# EAGLE design BUZZI-46-3 (EAGLE 5.02)
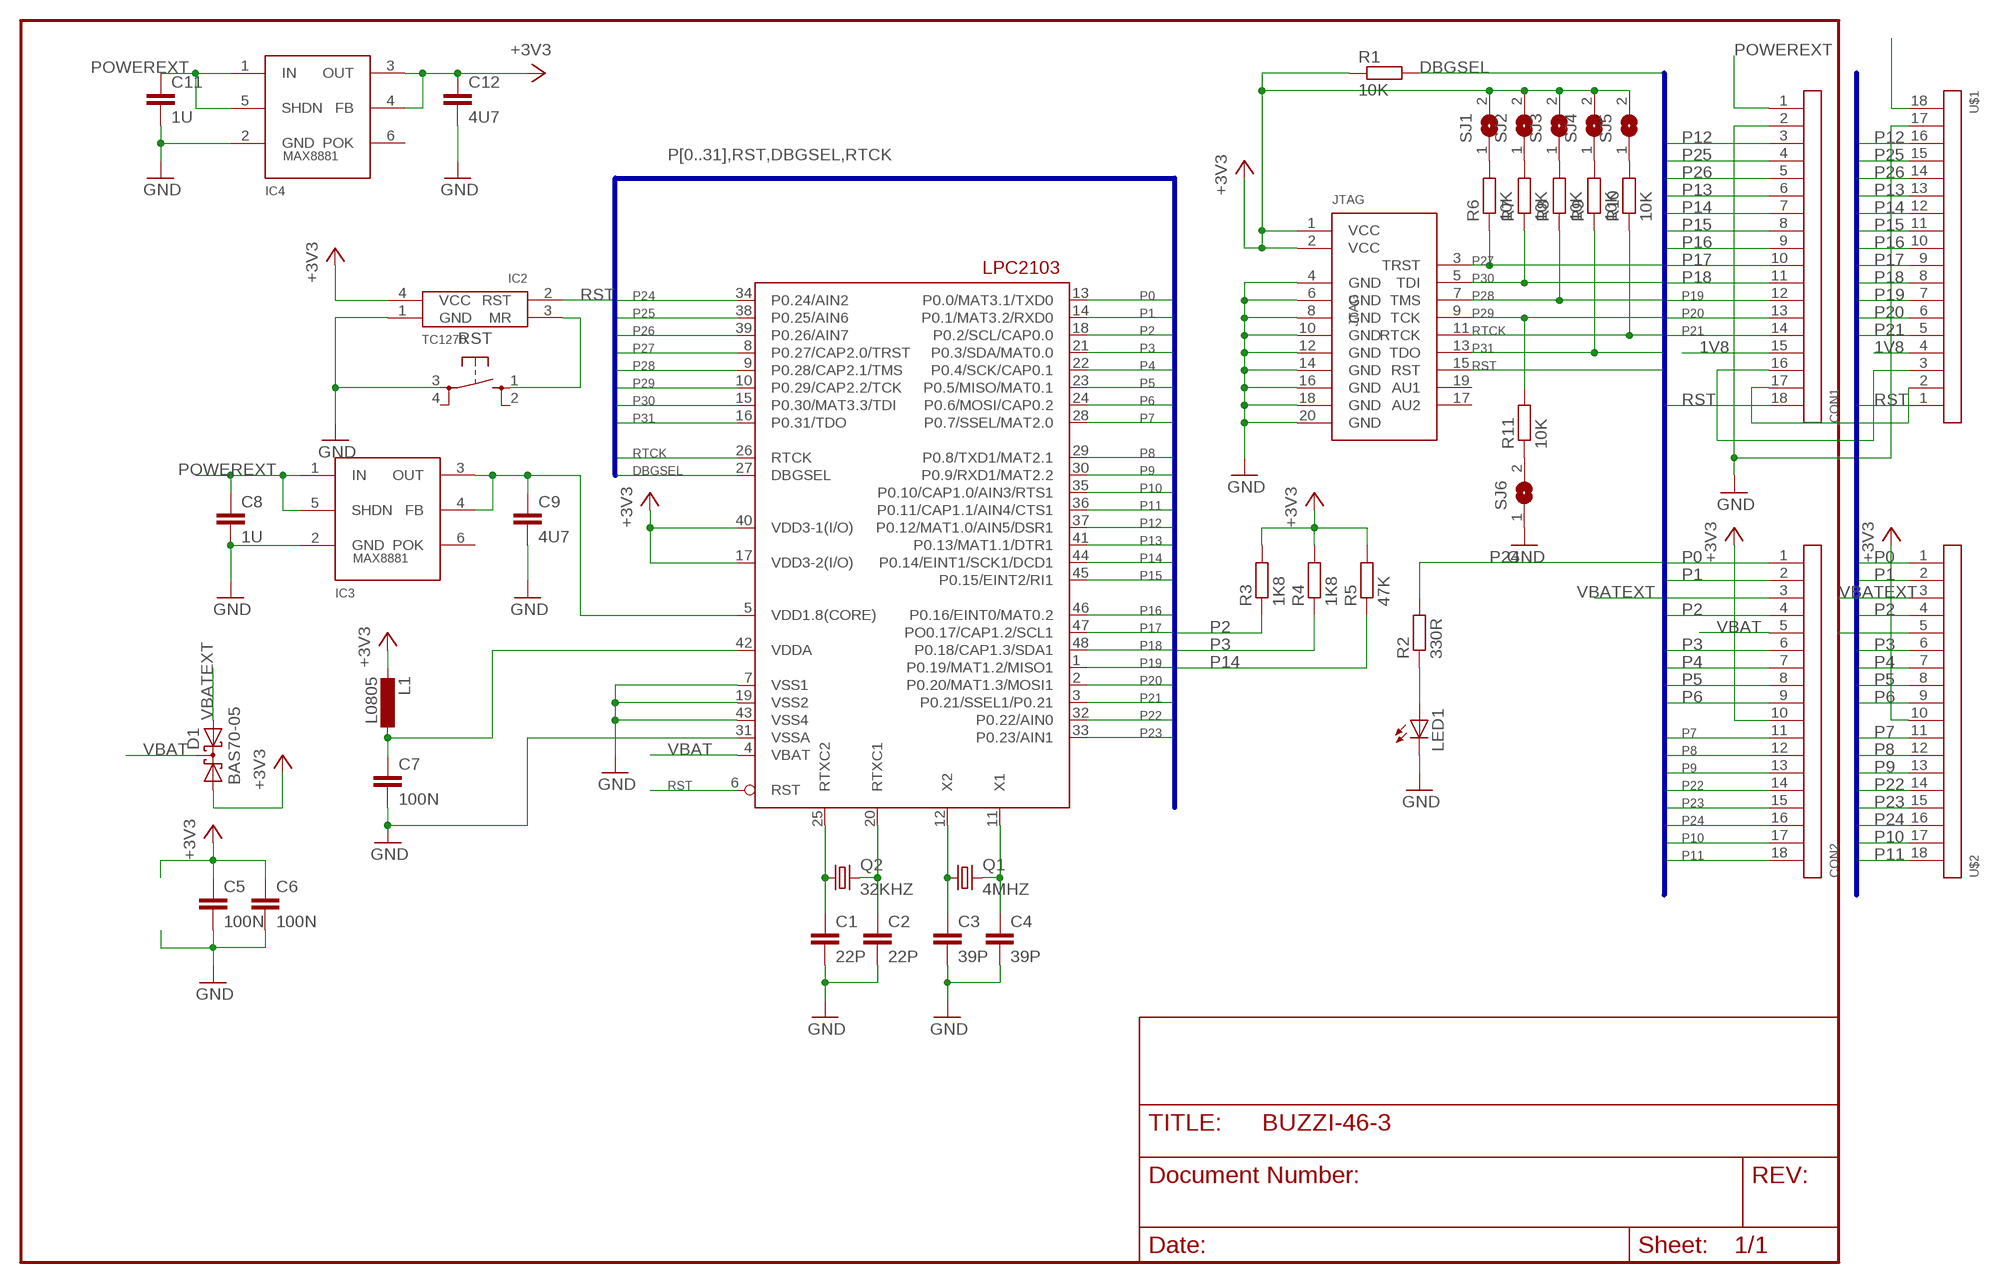
[diagram p0: schematic, sheet 1]

## Parts
C1  22P  C-EUC0603K  [C0603K]
C2  22P  C-EUC0603K  [C0603K]
C3  39P  C-EUC0603K  [C0603K]
C4  39P  C-EUC0603K  [C0603K]
C5  100N  C-EUC0805  [C0805]
C6  100N  C-EUC0805  [C0805]
C7  100N  C-EUC0603  [C0603]
C8  1U  C-EUC0805  [C0805]
C9  4U7  C-EUC0805  [C0805]
C11  1U  C-EUC0805  [C0805]
C12  4U7  C-EUC0805  [C0805]
CON1  CON18  [MA18-1]
CON2  CON18  [MA18-1]
D1  BAS70-05  [SOT23]
IC1  LPC2103  [LQFP48]
IC2  TC1270  [SOT143R_INFINEON]
IC3  MAX8881-18  MAX8881  [SOT23-6L]
IC4  MAX8881-33  MAX8881  [SOT23-6L]
JTAG  ARM-JTAGVERTIKAL  [ML20]
L1  L0805  [C0805]
LED1  LEDCHIPLED_0805  [CHIPLED_0805]
Q1  4MHZ  CRYTALHC49S  [HC49/S]
Q2  32KHZ  CRYTALTC26V  [TC26V]
R1  10K  R-EU_M0805  [M0805]
R2  330R  R-EU_M0805  [M0805]
R3  1K8  R-EU_M0805  [M0805]
R4  1K8  R-EU_M0805  [M0805]
R5  47K  R-EU_M0805  [M0805]
R6  10K  R-EU_M0805  [M0805]
R7  10K  R-EU_M0805  [M0805]
R8  10K  R-EU_M0805  [M0805]
R9  10K  R-EU_M0805  [M0805]
R10  10K  R-EU_M0805  [M0805]
R11  10K  R-EU_M0805  [M0805]
RST  10XXSMD  [B3F-10XX-SMD]
SJ1  SJ  [SJ]
SJ2  SJ  [SJ]
SJ3  SJ  [SJ]
SJ4  SJ  [SJ]
SJ5  SJ  [SJ]
SJ6  SJ  [SJ]
U$1  CON18  [MA18-1]
U$2  CON18  [MA18-1]

## Nets
1V8: C9.1 CON1.15 IC1.5(VDD1.8(CORE)) IC3.3(OUT) IC3.4(FB) U$1.4
+3V3: C5.1 C6.1 C12.1 CON2.10 D1.1(A1) IC1.17(VDD3-2(I/O)) IC1.40(VDD3-1(I/O)) IC2.4(VCC) IC4.3(OUT) IC4.4(FB) JTAG.1(VCC) JTAG.2(VCC) L1.2 R1.1 R3.2 R4.2 R5.2 SJ1.2 SJ2.2 SJ3.2 SJ4.2 SJ5.2 U$2.10
DBGSEL: IC1.27(DBGSEL) R1.2
GND: C1.2 C2.2 C3.2 C4.2 C5.2 C6.2 C7.2 C8.2 C9.2 C11.2 C12.2 CON1.2 IC1.7(VSS1) IC1.19(VSS2) IC1.31(VSSA) IC1.43(VSS4) IC2.1(GND) IC3.2(GND) IC4.2(GND) JTAG.4(GND) JTAG.6(GND) JTAG.8(GND) JTAG.10(GND) JTAG.12(GND) JTAG.14(GND) JTAG.16(GND) JTAG.18(GND) JTAG.20(GND) LED1.C RST.3 SJ6.1 U$1.17
N$1: IC2.3(MR) RST.1
N$2: R6.2 SJ1.1
N$3: LED1.A R2.1
N$4: C7.1 IC1.42(VDDA) L1.1
N$5: R7.2 SJ2.1
N$6: R8.2 SJ3.1
N$7: R9.2 SJ4.1
N$8: R10.2 SJ5.1
N$9: R11.1 SJ6.2
N$10: CON1.16 U$1.3
N$11: CON1.17 U$1.2
P0: CON2.1 IC1.13(P0.0/MAT3.1/TXD0) U$2.1
P1: CON2.2 IC1.14(P0.1/MAT3.2/RXD0) U$2.2
P2: CON2.4 IC1.18(P0.2/SCL/CAP0.0) R3.1 U$2.4
P3: CON2.6 IC1.21(P0.3/SDA/MAT0.0) R4.1 U$2.6
P4: CON2.7 IC1.22(P0.4/SCK/CAP0.1) U$2.7
P5: CON2.8 IC1.23(P0.5/MISO/MAT0.1) U$2.8
P6: CON2.9 IC1.24(P0.6/MOSI/CAP0.2) U$2.9
P7: CON2.11 IC1.28(P0.7/SSEL/MAT2.0) U$2.11
P8: CON2.12 IC1.29(P0.8/TXD1/MAT2.1) U$2.12
P9: CON2.13 IC1.30(P0.9/RXD1/MAT2.2) U$2.13
P10: CON2.17 IC1.35(P0.10/CAP1.0/AIN3/RTS1) U$2.17
P11: CON2.18 IC1.36(P0.11/CAP1.1/AIN4/CTS1) U$2.18
P12: CON1.3 IC1.37(P0.12/MAT1.0/AIN5/DSR1) U$1.16
P13: CON1.6 IC1.41(P0.13/MAT1.1/DTR1) U$1.13
P14: CON1.7 IC1.44(P0.14/EINT1/SCK1/DCD1) R5.1 U$1.12
P15: CON1.8 IC1.45(P0.15/EINT2/RI1) U$1.11
P16: CON1.9 IC1.46(P0.16/EINT0/MAT0.2) U$1.10
P17: CON1.10 IC1.47(PO0.17/CAP1.2/SCL1) U$1.9
P18: CON1.11 IC1.48(P0.18/CAP1.3/SDA1) U$1.8
P19: CON1.12 IC1.1(P0.19/MAT1.2/MISO1) U$1.7
P20: CON1.13 IC1.2(P0.20/MAT1.3/MOSI1) U$1.6
P21: CON1.14 IC1.3(P0.21/SSEL1/P0.21) U$1.5
P22: CON2.14 IC1.32(P0.22/AIN0) U$2.14
P23: CON2.15 IC1.33(P0.23/AIN1) U$2.15
P24: CON2.16 IC1.34(P0.24/AIN2) R2.2 U$2.16
P25: CON1.4 IC1.38(P0.25/AIN6) U$1.15
P26: CON1.5 IC1.39(P0.26/AIN7) U$1.14
P27: IC1.8(P0.27/CAP2.0/TRST) JTAG.3(TRST) R6.1
P28: IC1.9(P0.28/CAP2.1/TMS) JTAG.7(TMS) R8.1
P29: IC1.10(P0.29/CAP2.2/TCK) JTAG.9(TCK) R11.2
P30: IC1.15(P0.30/MAT3.3/TDI) JTAG.5(TDI) R7.1
P31: IC1.16(P0.31/TDO) JTAG.13(TDO) R9.1
POWEREXT: C8.1 C11.1 CON1.1 IC3.1(IN) IC3.5(SHDN) IC4.1(IN) IC4.5(SHDN) U$1.18
RST: CON1.18 IC1.6(RST) IC2.2(RST) JTAG.15(RST) U$1.1
RTCK: IC1.26(RTCK) JTAG.11(RTCK) R10.1
RTXC1: C2.1 IC1.20(RTXC1) Q2.2
RTXC2: C1.1 IC1.25(RTXC2) Q2.1
VBAT: CON2.5 D1.3(C) IC1.4(VBAT) U$2.5
VBATEXT: CON2.3 D1.2(A2) U$2.3
X1: C4.1 IC1.11(X1) Q1.2
X2: C3.1 IC1.12(X2) Q1.1
Unconnected: IC3.6(POK) IC4.6(POK) JTAG.17(AU2) JTAG.19(AU1) RST.2 RST.4

## Buses
P[0..31],RST,DBGSEL,RTCK

## Library data of the parts
C1-C9 C11 C12 = turbod3:C-EU: CAPACITOR, European symbol
CON1 CON2 U$1 U$2 = turbod3:CON18
D1 = diode:BAS70-05: Silicon Schottky Diodes General-purpose diode for high-speed switching
IC1 = turbod3:LPC2103: LPC2101/2102/2103 microcontroler from Philips
IC2 = turbod3:TC1270
IC3 IC4 = turbod3:MAX8881
JTAG = turbod3:ARM-JTAG
L1 = turbod3:L
LED1 = led:LED: LED OSRAM: - CHIPLED LG R971, LG N971, LY N971, LG Q971, LY Q971, LO R971, LY R971 LH N974, LH R974 LS Q976, LO Q976, LY Q976 LO Q996 - Hyper CHIPLED LW Q18S LB Q993, LB Q99A, LB R99A - SideLED LS A670, LO A670, LY A670, LG A670, LP A670 LB A673, LV A673, LT A673, LW A673 LH A674 LY A675 LS A676, LA A676, LO A676, LY A676, LW A676 LS A679, LY A679, LG A679 - Hyper Micro SIDELED® LS Y876, LA Y876, LO Y876, LY Y876 LT Y87S - SmartLED LW L88C, LW L88S LB L89C, LB L89S, LG L890 LS L89K, LO L89K, LY L89K LS L896, LA L896, LO L896, LY L896 - TOPLED LS T670, LO T670, LY T670, LG T670, LP T670 LSG T670, LSP T670, LSY T670, LOP T670, LYG T670 LG T671, LOG T671, LSG T671 LB T673, LV T673, LT T673, LW T673 LH T674 LS T676, LA T676, LO T676, LY T676, LB T676, LH T676, LSB T676, LW T676 LB T67C, LV T67C, LT T67C, LS T67K, LO T67K, LY T67K, LW E67C LS E67B, LA E67B, LO E67B, LY E67B, LB E67C, LV E67C, LT E67C LW T67C LS T679, LY T679, LG T679 LS T770, LO T770, LY T770, LG T770, LP T770 LB T773, LV T773, LT T773, LW T773 LH T774 LS E675, LA E675, LY E675, LS T675 LS T776, LA T776, LO T776, LY T776, LB T776 LHGB T686 LT T68C, LB T68C - Hyper Mini TOPLED® LB M676 - Mini TOPLED Santana® LG M470 LS M47K, LO M47K, LY M47K Source: http://www.osram.convergy.de/
Q1 Q2 = turbod3:CRYTAL: CRYSTAL
R1-R11 = turbod3:R-EU_: RESISTOR, European symbol
RST = turbod3:10XX
SJ1-SJ6 = jumper:SJ: SMD solder JUMPER

## Board
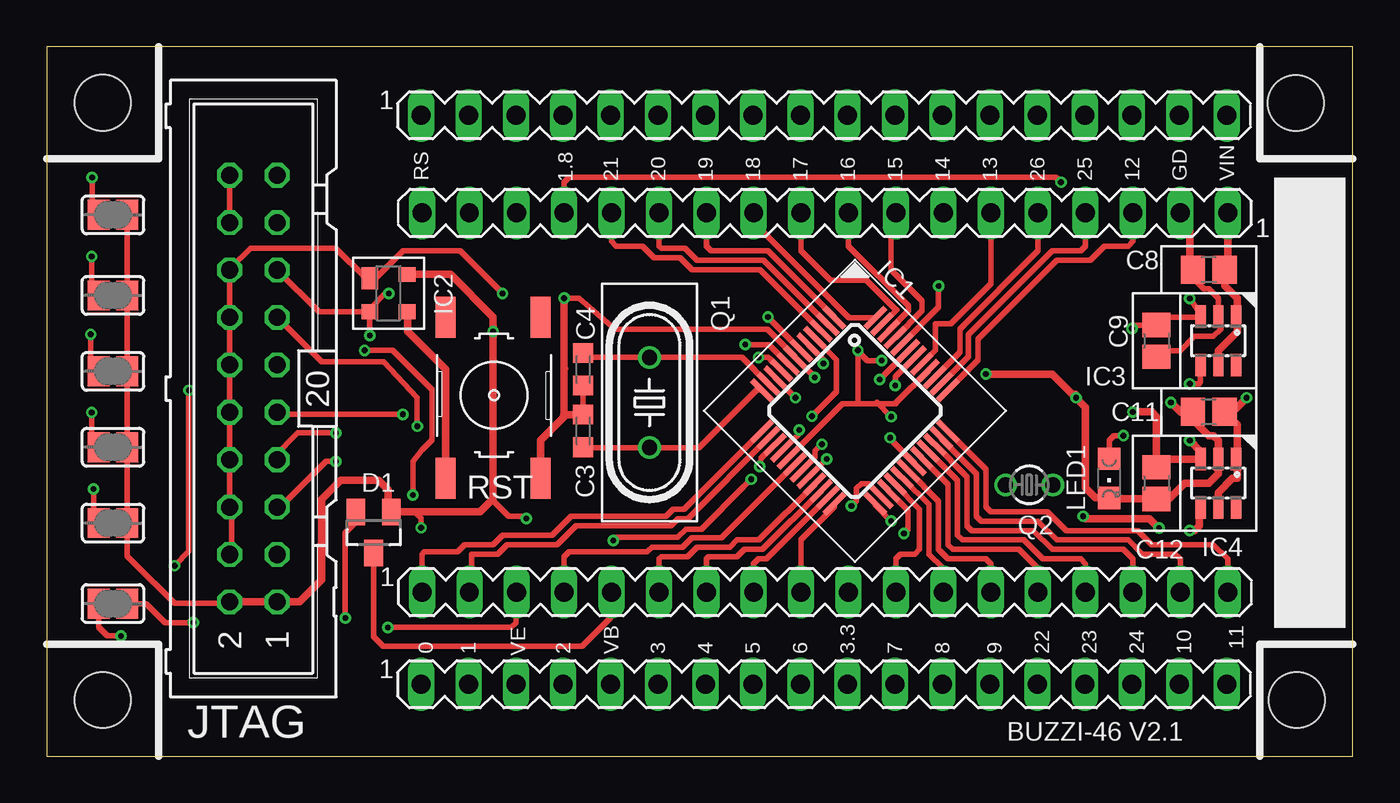
[diagram p1: board, top side]
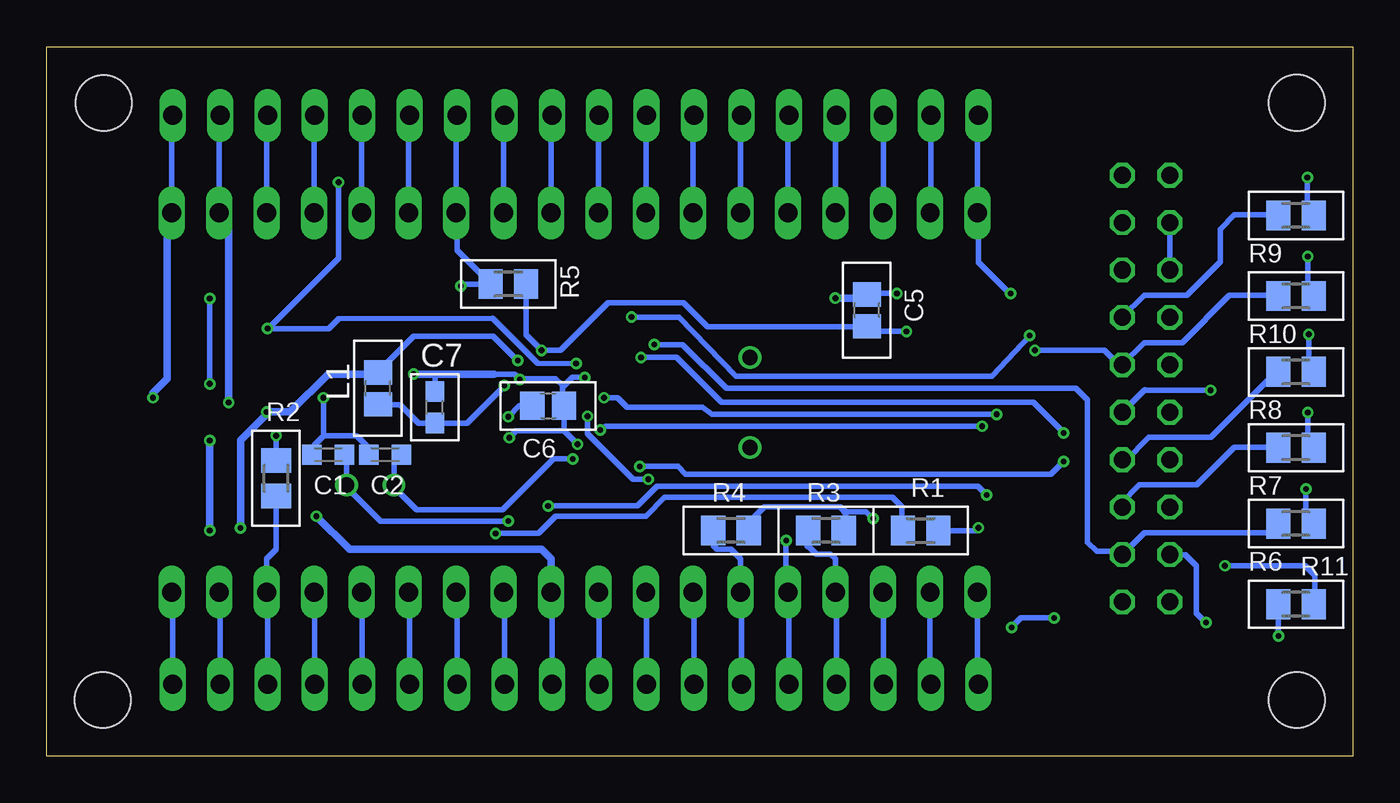
[diagram p2: board, bottom side, seen from below]

Size 70 x 38 mm. Coordinates in mm from the lower left corner, seen from the top.
Outline: 0,0 70,0 70,38 0,38 0,0
Copper layers (1*16): Top 0.035mm / dielectric 1.5mm / Bottom 0.035mm
Design rules "PCB-POOL": minimum track width 6mil, minimum drill 12mil, track to track 6mil, track to pad 6mil, pad to pad 6mil, via to via 6mil, smd to smd 6mil, copper to edge 20mil, drill to drill 8mil, minimum pad ring 8mil, minimum via ring 6mil, stop-mask expansion 3mil, vias tented up to drill 0mil, thermal gap 8mil
Holes 3 mm at 3,35 66.94,34.98 67,3 3,3

### Footprints (pad centres in the part's own frame; a part is rotated, then mirrored left to right if it is on the bottom)
C0603K = smd 1.05 x 1.08: 1 -0.875,0; 2 0.875,0
C0805 = smd 1.3 x 1.5: 1 -0.85,0; 2 0.85,0
C0603 = smd 1.1 x 1: 1 -0.85,0; 2 0.85,0
MA18-1 = drill 1.016 long: 1 -24.13,0; 2 -21.59,0; 3 -19.05,0; 4 -16.51,0; 5 -13.97,0; 6 -11.43,0; 7 -8.89,0; 8 -6.35,0; 9 -3.81,0; 10 -1.27,0; 11 1.27,0; 12 3.81,0; 13 6.35,0; 14 8.89,0; 15 11.43,0; 16 13.97,0; 17 16.51,0; 18 19.05,0
SOT23 = smd 1 x 1.4: 1 -0.95,-1.1; 2 0.95,-1.1; 3 0,1.1
LQFP48 = smd 1.5 x 0.3: 1 -4.3,2.75; 2 -4.3,2.25; 3 -4.3,1.75; 4 -4.3,1.25; 5 -4.3,0.75; 6 -4.3,0.25; 7 -4.3,-0.25; 8 -4.3,-0.75; 9 -4.3,-1.25; 10 -4.3,-1.75; 11 -4.3,-2.25; 12 -4.3,-2.75; 25 4.3,-2.75; 26 4.3,-2.25; 27 4.3,-1.75; 28 4.3,-1.25; 29 4.3,-0.75; 30 4.3,-0.25; 31 4.3,0.25; 32 4.3,0.75; 33 4.3,1.25; 34 4.3,1.75; 35 4.3,2.25; 36 4.3,2.75 | smd 0.3 x 1.5: 13 -2.75,-4.3; 14 -2.25,-4.3; 15 -1.75,-4.3; 16 -1.25,-4.3; 17 -0.75,-4.3; 18 -0.25,-4.3; 19 0.25,-4.3; 20 0.75,-4.3; 21 1.25,-4.3; 22 1.75,-4.3; 23 2.25,-4.3; 24 2.75,-4.3; 37 2.75,4.3; 38 2.25,4.3; 39 1.75,4.3; 40 1.25,4.3; 41 0.75,4.3; 42 0.25,4.3; 43 -0.25,4.3; 44 -0.75,4.3; 45 -1.25,4.3; 46 -1.75,4.3; 47 -2.25,4.3; 48 -2.75,4.3
SOT143R_INFINEON = smd 1.2 x 0.9: 1 -0.8,-1 | smd 0.8 x 0.9: 2 1,-1; 3 1,1; 4 -1,1
SOT23-6L = smd 0.55 x 1.2: 1 -0.95,-1.3; 2 0,-1.3; 3 0.95,-1.3; 4 0.95,1.3; 5 0,1.3; 6 -0.95,1.3
ML20 = drill 0.914 octagon: 1 -11.43,-1.27; 2 -11.43,1.27; 3 -8.89,-1.27; 4 -8.89,1.27; 5 -6.35,-1.27; 6 -6.35,1.27; 7 -3.81,-1.27; 8 -3.81,1.27; 9 -1.27,-1.27; 10 -1.27,1.27; 11 1.27,-1.27; 12 1.27,1.27; 13 3.81,-1.27; 14 3.81,1.27; 15 6.35,-1.27; 16 6.35,1.27; 17 8.89,-1.27; 18 8.89,1.27; 19 11.43,-1.27; 20 11.43,1.27
CHIPLED_0805 = smd 1.2 x 1.2: A 0,-1.05; C 0,1.05
HC49/S = drill 0.813 round: 1 -2.413,0; 2 2.413,0
TC26V = drill 0.813 round: 1 -1.27,0; 2 1.27,0
M0805 = smd 1.3 x 1.6: 1 -0.95,0; 2 0.95,0
B3F-10XX-SMD = smd 2.184 x 1.067: 1 -4.572,2.54; 2 4.064,2.54; 3 -4.572,-2.54; 4 4.064,-2.54
SJ = smd 1.168 x 1.6: 1 -0.762,0; 2 0.762,0

### Placement (x,y rotation side)
C1  54.91,16.14 180 bottom
C2  51.86,16.14 180 bottom
C3  28.75,17.41 90 top
C4  28.75,20.72 270 top
C5  26.05,23.88 90 bottom
C6  43.12,18.76 0 bottom
C7  49.2,18.68 90 bottom
C8  62.28,26.05 180 top
C9  59.48,22.24 270 top
C11  62.28,18.43 180 top
C12  59.48,14.62 270 top
CON1  39.16,29.1 180 top
CON2  44.24,8.78 0 top
D1  17.53,11.97 180 top
IC1  43.32,18.49 315 top
IC2  18.32,24.8 270 top
IC3  62.78,22.24 180 top
IC4  62.78,14.62 180 top
JTAG  11.08,19.68 90 top
L1  52.24,19.7 90 bottom
LED1  56.94,14.87 180 top
Q1  32.3,18.94 90 top
Q2  52.66,14.52 180 top
R1  23.16,12.08 180 bottom
R2  57.7,14.87 270 bottom
R3  28.24,12.08 0 bottom
R4  33.32,12.08 0 bottom
R5  45.26,25.29 0 bottom
R6  3.05,12.45 0 bottom
R7  3.05,16.51 0 bottom
R8  3.05,20.58 0 bottom
R9  3.05,28.96 0 bottom
R10  3.05,24.64 0 bottom
R11  3.05,8.13 0 bottom
RST  23.92,19.45 90 top
SJ1  3.56,12.48 0 top
SJ2  3.56,16.54 0 top
SJ3  3.56,20.61 0 top
SJ4  3.56,28.99 0 top
SJ5  3.56,24.67 0 top
SJ6  3.56,8.16 180 top
U$1  44.2,34.32 0 top
U$2  44.2,3.84 0 top

### Tracks (layer width: path | path; a pad name or v marks a point on that pad's centre or on a via)
1V8  (via drill 0.3)
  Top 0.305: 59.48,23.08 59.48,23.49 61.8,23.49 IC3.3 61.87,23.65 v61.26,24.51 | 61.96,21.02 IC3.4 61.83,20.02 61.77,19.95 61.26,19.95 v61.26,19.94 | v41.63,21.02 41.63,21.25 IC1.5 40.81,22.09 | 59.48,23.08 C9.1 | v58.16,22.9 58.34,23.08 59.48,23.08 | CON1.15 27.73,30.73 28,31 54.09,31 v54.36,30.73
  Bottom 0.305: v61.26,24.51 v61.26,19.94 | v41.63,21.02 43.68,21.05 46.1,23.46 54.35,23.43 54.88,22.9 v58.16,22.9 58.16,22.86 | U$1.4 27.69,34.29 27.73,34.24 CON1.15 | 58.16,22.86 58.17,22.86 | v54.36,30.73 54.36,26.67 58.16,22.86
+3V3  (via drill 0.3)
  Top 0.305: IC1.17 39.76,15.98 42.64,18.86 43.48,18.86 | 43.48,18.86 44.5,18.86 | 44.5,18.86 45.51,18.86 45.51,18.92 IC1.40 | 43.48,18.86 v43.48,21.73 v43.47,21.73 43.46,21.72 43.99,21.18 v44.76,21.18 | IC1.40 47.24,20.67 | 19.86,25.8 19.6,25.8 IC2.4 | 44.5,18.86 44.5,18.94 v45.26,18.18 | v25.7,12.71 25.7,12.84 24.75,12.84 23.88,13.72 | JTAG.2 9.73,8.25 | 9.86,8.25 | JTAG.2 9.86,8.25 | 9.86,8.25 | JTAG.2 9.83,8.25 9.91,8.18 6.86,8.18 4.62,10.42 4.6,10.42 4.32,10.7 SJ1.2 | 18.48,13.05 18.54,12.99 | 18.48,13.05 D1.1 | 18.29,13.24 18.48,13.05 | 19.81,13.07 19.81,12.99 20.07,12.73 v20.07,12.23 | SJ5.2 4.32,24.42 | SJ5.2 SJ4.2 | SJ5.2 SJ3.2 SJ2.2 SJ1.2 | SJ1.2 4.32,12.23 | IC1.40
  Top 0.406: v61.26,16.91 61.83,16.33 IC4.3 61.78,15.9 61.77,15.89 59.99,15.89 59.59,15.49 C12.1 59.48,18.18 59.23,18.43 v58.21,18.43 | v61.26,12.08 61.51,12.08 61.77,12.33 61.77,13.1 61.83,13.16 IC4.4 | 19.6,25.8 21.64,25.8 23.92,23.51 v23.92,22.75 23.92,13.76 23.88,13.72 23.23,13.07 19.81,13.07 D1.1 | v55.55,12.84 55.67,12.71 59.1,12.71 v59.61,12.21 | JTAG.2 9.81,8.2 | JTAG.2 | JTAG.2 9.81,8.3 | 9.86,8.25 JTAG.1 13.55,8.25 14.73,9.43 14.73,13.75 15.75,14.77 17.78,14.77 18.29,14.26 18.29,13.24
  Bottom 0.305: L1.2 52.24,20.59 50.34,22.49 46.06,22.49 v44.76,21.18 | 26.21,23 26.18,23.02 C5.1 | v23.92,22.75 25.95,22.75 26.21,23 | 26.21,23 34.59,23 35.86,24.27 39.92,24.27 42.46,21.73 v43.48,21.73 44.32,22.57 R5.2 | R5.2 44.32,25.31 | R5.2 | C6.1 44.67,18.76 v45.26,18.18 | v25.7,12.71 26.08,13.1 27.22,13.1 27.48,13.35 31.54,13.35 32.37,12.52 R4.2 | R1.1 20.21,12.08 v20.07,12.23 | 27.18,13.05 27.18,12.19 | R4.2 32.26,11.97 | R4.2 | CON2.10 42.97,8.84 42.93,8.89 U$2.10
  Bottom 0.406: v61.26,16.91 v61.26,12.08 | L1.2 52.2,20.55 52.12,20.46 54.91,20.46 56.94,18.43 v58.21,18.43 58.21,18.3 59.61,16.91 v59.61,12.21 | CON2.10 42.97,10.56 43.48,11.06 53.77,11.06 v55.55,12.84 | 27.18,12.19 R3.2 | 27.22,13.1 27.18,13.05
DBGSEL  (via drill 0.3)
  Top 0.305: IC1.27 45.1,14.22 46.15,13.17 46.15,12.13 v45.94,11.93
  Bottom 0.305: v45.94,11.93 43.63,11.93 42.72,12.84 37.89,12.84 36.88,13.86 24.68,13.86 24.18,13.35 24.18,12.33 R1.2 24.11,12.52 24.18,12.59
GND  (via drill 0.3)
  Top 0.305: C9.2 59.61,21.59 59.48,21.72 60.75,21.72 61.51,22.48 62.53,22.48 62.91,22.86 IC3.2 62.88,23.65 62.78,23.75 62.78,24.51 62.28,25.02 62.02,25.02 61.55,25.49 C8.2 | C3.2 C4.2 | v24.43,24.78 22.14,27.07 19.1,27.07 17.63,25.6 IC2.1 17.11,25.6 15.49,27.21 10.92,27.21 9.81,26.1 JTAG.16 9.81,25.88 | v27.73,24.53 28.52,24.53 30.45,22.85 38.63,22.85 40.1,21.38 IC1.7 v41.17,20.28 | IC1.19 40.48,15.28 41.17,15.99 41.17,16.35 v41.55,16.7 | IC1.43 45.34,20.87 v44.64,20.16 | 61.53,17.91 61.53,18.41 | v55.16,19.19 55.16,19.45 54.91,19.45 | JTAG.4 9.91,10.89 9.91,13.43 JTAG.6 JTAG.8 JTAG.10 JTAG.12 | JTAG.12 9.81,21 | JTAG.12 | JTAG.12 JTAG.14 9.81,25.88 | JTAG.20 9.81,31.21 | JTAG.20 | JTAG.18 JTAG.20 | 9.81,25.88 9.81,26.28 | IC1.31 46.53,15.65 45.21,16.98 v45.21,17.05 | v7.87,7.15 6.35,7.15 5.33,8.16 SJ6.1
  Top 0.406: C8.2 61.5,26.03 61.51,26.05 61.26,26.3 61.26,28.59 CON1.2 | RST.3 26.46,16.91 27.73,18.18 27.73,18.25 | 28.75,18.18 C3.2 27.74,18.29 27.71,18.25 27.73,18.25 | C4.2 28.61,19.84 | v27.73,24.53 27.73,20.74 | 27.73,20.74 27.73,20.72 | v60.24,18.94 60.77,18.41 C11.2 61.53,18.41 | 62.78,15.89 62.78,15.64 | 62.78,15.89 IC4.2 | 62.78,15.89 62.78,15.13 62.28,14.62 61.01,14.62 60.17,13.79 C12.2 57.03,13.77 56.94,13.86 LED1.C 56.21,13.82 55.67,14.37 55.67,18.68 v55.16,19.19 54.91,19.45 53.89,20.46 v50.34,20.46 | 61.53,17.91 62.28,17.16 62.53,17.16 62.78,16.91 62.78,15.89 | 27.73,20.74 27.76,20.74 27.73,20.72 | 27.73,20.72 27.73,18.25
  Bottom 0.305: C2.2 52.74,16.51 53.39,17.16 55.16,17.16 | 55.16,17.16 55.67,16.65 55.67,16.14 C1.2 | JTAG.16 JTAG.18 | C5.2 26.15,24.73 26.21,24.78 v24.43,24.78 | v41.17,20.28 41.83,20.28 42.36,19.75 | 42.36,19.75 42.36,18.71 42.31,18.66 42.27,18.7 C6.2 42.26,18.75 42.26,17.41 | 42.26,17.41 v41.55,16.7 | v55.16,19.19 55.16,17.16 | 42.36,19.75 42.36,19.85 42.72,20.21 44.59,20.21 44.63,20.17 | 42.26,17.41 44.85,17.41 v45.21,17.05 | 49.33,20.46 49.33,20.51 49.2,20.38 C7.2 | JTAG.4 8.98,10.79 8.38,10.19 8.38,7.65 v7.87,7.15 | U$1.17 60.71,34.29 60.75,34.24 CON1.2 | 44.63,20.17 v44.63,20.16 v44.64,20.16 | 46.01,20.46 44.92,20.46 44.63,20.17
  Bottom 0.406: 26.01,24.73 25.95,24.78 | C5.2 26.01,24.73 | v27.73,24.53 26.21,24.53 26.01,24.73 | v60.24,18.94 60.24,28.59 CON1.2 | v50.34,20.46 49.33,20.46 46.01,20.46
N$1
  Top 0.406: RST.1 21.38,20.72 19.35,22.75 19.35,23.76 IC2.3
N$2  (via drill 0.3)
  Top 0.305: SJ1.1 2.52,12.48 v2.52,14.31
  Bottom 0.305: R6.2 2.28,12.45 2.52,12.68 v2.52,14.31
N$3  (via drill 0.3)
  Top 0.305: v57.7,17.16 57.2,17.16 56.94,16.91 LED1.A
  Bottom 0.305: 57.38,15.82 R2.1 v57.7,17.16
N$4  (via drill 0.3)
  Top 0.305: IC1.42 46.56,21.4 45.49,20.33 v45.47,19.85
  Bottom 0.305: L1.1 52.3,18.85 52.32,18.83 51.05,18.83 50.06,17.83 C7.1 47.48,17.83 v45.47,19.85
N$5  (via drill 0.3)
  Top 0.305: v2.41,18.4 2.41,16.93 SJ2.1
  Bottom 0.305: R7.2 2.1,16.81 2.41,17.13 v2.41,18.4
N$6  (via drill 0.3)
  Top 0.305: SJ3.1 2.74,20.61 2.36,20.99 v2.36,22.59
  Bottom 0.305: R8.2 2.1,20.75 2.36,21.01 v2.36,22.59
N$7  (via drill 0.3)
  Top 0.305: SJ4.1 2.79,29.04 2.44,29.4 v2.44,31
  Bottom 0.305: R9.2 2.1,29.06 2.44,29.4 v2.44,31
N$8  (via drill 0.3)
  Top 0.305: SJ5.1 2.79,24.62 2.41,25 v2.41,26.75
  Bottom 0.305: R10.2 2.13,24.64 2.41,24.93 v2.41,26.75
N$9  (via drill 0.3)
  Top 0.305: v3.99,6.43 3.25,6.43 2.79,6.89 2.79,8.09 2.82,8.11 2.79,8.14 SJ6.2
  Bottom 0.305: R11.1 4,6.45 v3.99,6.43
N$10
  Bottom 0.305: 25.15,28.96 25.15,29.05 | 25.15,29.05 CON1.16 | U$1.3 25.15,29.05
N$11
  Bottom 0.305: CON1.17 22.61,29.14 U$1.2
P0
  Top 0.305: IC1.13 34.16,13.22 33.57,13.22 33.19,12.84 28.11,12.84 27.1,11.83 24.43,11.83 23.92,11.32 22.4,11.32 22.02,10.94 20.24,10.94 20.11,10.81 CON2.1
  Bottom 0.305: 20.29,3.84 20.32,3.81 | U$2.1 20.29,3.84 | CON2.1 20.11,4.02 20.29,3.84
P1
  Top 0.305: IC1.14 34.36,12.71 33.83,12.71 33.45,12.33 28.37,12.33 27.35,11.32 24.68,11.32 24.18,10.81 22.78,10.81 22.78,8.9 CON2.2
  Bottom 0.305: U$2.2 22.61,3.81 22.65,3.86 CON2.2
P2
  Top 0.305: IC1.18 36.17,11.7 34.59,11.7 34.08,11.19 32.43,11.19 32.18,10.94 27.99,10.94 27.73,10.68 CON2.4
  Bottom 0.305: 29.19,11.25 28.75,10.81 27.99,10.81 27.73,10.56 CON2.4 27.73,8.84 27.69,8.89 U$2.4
  Bottom 0.406: 29.19,11.25 R3.1
P3
  Top 0.305: IC1.21 38.17,11.57 37,11.57 36.62,11.19 34.84,11.19 34.34,10.68 32.94,10.68 32.81,10.56 CON2.6
  Bottom 0.305: R4.1 34.27,11.25 34.08,11.06 33.32,11.06 32.81,10.56 CON2.6 32.81,8.84 32.77,8.89 U$2.6
P4
  Top 0.305: IC1.22 38.37,11.06 37.38,11.06 37,10.68 35.48,10.68 35.35,10.56 CON2.7
  Bottom 0.305: 35.45,8.78 35.56,8.89 | 35.45,8.78 CON2.7 | U$2.7 35.31,8.64 35.45,8.78
P5
  Top 0.305: IC1.23 38.56,10.56 38.15,10.56 37.89,10.3 CON2.8
  Bottom 0.305: CON2.8 37.89,8.84 37.85,8.89 U$2.8
P6
  Top 0.305: IC1.24 42.22,13.36 40.43,11.57 CON2.9
  Bottom 0.305: CON2.9 40.43,8.84 40.39,8.89 U$2.9
P7
  Top 0.305: IC1.28 45.48,14.53 46.78,13.22 46.78,11.06 46.53,10.81 45.77,10.81 45.51,10.56 CON2.11
  Bottom 0.305: CON2.11 45.51,8.84 45.47,8.89 U$2.11
P8
  Top 0.305: IC1.29 45.95,14.81 47.29,13.48 47.29,10.81 48.05,10.05 CON2.12
  Bottom 0.305: 48.15,8.78 48.26,8.89 | 48.15,8.78 CON2.12 | U$2.12 48.01,8.64 48.15,8.78
  Bottom 0.406: 48.01,8.96 48.05,8.91 CON2.12
P9
  Top 0.305: IC1.30 47.8,13.66 47.8,11.06 48.31,10.56 50.34,10.56 50.59,10.3 CON2.13
  Bottom 0.305: CON2.13 50.59,9.1 50.55,9.14 U$2.13
P10
  Top 0.305: IC1.35 47.95,17.01 49.83,15.13 49.83,12.84 50.08,12.59 53.13,12.59 54.15,11.57 57.96,11.57 58.72,10.81 60.5,10.81 60.75,10.56 60.75,8.75 | 60.75,8.75 CON2.17 | 60.75,8.75 60.71,8.7
  Bottom 0.305: CON2.17 60.75,8.84 60.71,8.89 U$2.17
  Bottom 0.406: CON2.17 60.88,8.78 60.96,8.7 60.75,8.49
P11
  Top 0.305: IC1.36 50.34,15.36 50.34,13.35 50.59,13.1 53.64,13.1 54.66,12.08 58.47,12.08 59.23,11.32 62.53,11.32 63.29,10.56 CON2.18
  Top 0.406: 63.25,8.96 63.29,8.91 CON2.18
  Bottom 0.305: CON2.18 63.29,8.84 63.25,8.89 U$2.18
P12
  Top 0.305: IC1.37 49.91,21.19 49.91,22.32 54.15,26.56 55.93,26.56 56.69,27.32 57.96,27.32 58.21,27.57 CON1.3
  Bottom 0.305: U$1.16 58.17,34.54 58.21,34.5 CON1.3
P13
  Top 0.305: IC1.41 47.62,21.73 47.62,23.15 48.46,23.15 50.59,25.29 CON1.6
  Bottom 0.305: U$1.13 50.55,34.29 50.59,34.24 CON1.6
P14  (via drill 0.3)
  Top 0.305: IC1.44 47.8,24.03 v47.8,25.19
  Bottom 0.305: v47.8,25.19 47.72,25.26 46.22,25.26 46.22,25.27 R5.1 48,27.08 48,29.05 CON1.7 48.05,34.5 48.01,34.54 U$1.12
P15
  Top 0.305: IC1.45 45.48,22.42 46.91,23.84 46.91,24.4 45.26,26.05 45.26,28.84 CON1.8
  Bottom 0.305: U$1.11 45.47,34.54 45.51,34.5 CON1.8
P16
  Top 0.305: IC1.46 45.12,22.79 46.17,23.84 46.17,24.12 42.97,27.32 CON1.9
  Bottom 0.305: U$1.10 42.93,34.29 42.97,34.24 CON1.9
P17
  Top 0.305: IC1.47 45.56,23.92 45.51,23.92 43.94,25.49 42.01,25.49 40.43,27.07 CON1.10
  Bottom 0.305: U$1.9 40.39,34.54 40.43,34.5 CON1.10
P18
  Top 0.305: IC1.48 43.01,23.48 37.89,28.59
  Top 0.406: CON1.11 37.89,28.59
  Bottom 0.305: U$1.8 37.85,34.54 37.89,34.5 CON1.11
P19
  Top 0.305: IC1.1 42.22,23.5 38.65,27.07 35.61,27.07 35.35,27.32 CON1.12
  Bottom 0.305: U$1.7 35.31,34.54 35.35,34.5 CON1.12
P20
  Top 0.305: IC1.2 41.96,23.02 38.42,26.56 34.84,26.56 34.21,27.19 32.94,27.19 32.81,27.32 CON1.13
  Bottom 0.305: U$1.6 32.77,34.29 32.81,34.24 CON1.13
P21
  Top 0.305: IC1.3 41.46,22.81 38.22,26.05 34.59,26.05 33.95,26.68 32.56,26.68 31.92,27.32 30.53,27.32 30.27,27.57 CON1.14
  Bottom 0.305: U$1.5 30.23,34.54 30.27,34.5 CON1.14
P22
  Top 0.305: IC1.32 48.31,14.56 48.31,11.32 48.56,11.06 52.12,11.06 53.13,10.05 CON2.14
  Bottom 0.305: 53.23,8.78 53.34,8.89 | 53.23,8.78 CON2.14 | U$2.14 53.09,8.64 53.23,8.78
P23
  Top 0.305: IC1.33 48.81,14.76 48.81,11.83 49.07,11.57 52.37,11.57 53.39,10.56 55.42,10.56 55.67,10.3 CON2.15
  Bottom 0.305: 55.77,8.78 55.88,8.89 | 55.77,8.78 CON2.15 | U$2.15 55.63,8.64 55.77,8.78
P24
  Top 0.305: IC1.34 49.32,14.96 49.32,12.33 49.58,12.08 52.88,12.08 53.89,11.06 57.7,11.06 58.21,10.56 CON2.16
  Bottom 0.305: R2.2 57.7,11.06 58.21,10.56 CON2.16 58.28,8.78 58.42,8.64 58.17,8.38 U$2.16
P25
  Top 0.305: IC1.38 49.4,21.39 49.4,22.57 53.89,27.07 55.42,27.07 55.67,27.32 CON1.4
  Bottom 0.305: U$1.15 55.63,34.29 55.67,34.24 CON1.4
P26
  Top 0.305: IC1.39 48.94,21.64 48.94,22.88 53.13,27.07 CON1.5
  Bottom 0.305: U$1.14 53.09,34.29 53.13,34.24 CON1.5
P27  (via drill 0.3)
  Top 0.305: 39.74,21 IC1.8 | IC1.8 39.82,20.92 | v37.44,22.04 38.7,22.04 IC1.8
  Bottom 0.305: v37.44,22.04 35.91,22.04 33.57,19.7 14.84,19.7 14.22,19.08 14.22,11.46 13.72,10.96 12.7,10.96 12.45,10.7 JTAG.3 | JTAG.3 | 4.06,12.45 R6.1 4.03,12.45 4.06,12.48 4.57,11.97 11.18,11.97 JTAG.3
P28  (via drill 0.3)
  Top 0.305: IC1.9 38.92,21.11 | 38.92,21.11 38.76,21.27 | 38.92,21.11 38.91,21.1 38.65,21.35 v38.15,21.35 | JTAG.7 12.19,16.04 13.46,17.31 v15.49,17.31
  Bottom 0.305: v38.15,21.35 36.24,21.35 33.83,18.94 17.13,18.94 v15.49,17.31 | JTAG.7 12.27,15.87 12.19,15.8 10.92,17.07 7.6,17.07 4.06,20.61 4.03,20.58 R8.1
P29  (via drill 0.3)
  Top 0.305: IC1.10 39.04,20.28 v40.13,19.19 | v7.62,19.59 7.62,10.96 v6.86,10.19 | JTAG.9 12.19,18.58 | JTAG.9 | v19.1,18.3 12.46,18.3 JTAG.9
  Bottom 0.305: v19.1,18.3 34.34,18.3 34.84,18.68 38.91,18.68 39.42,19.19 v40.13,19.19 | 2.03,8.13 R11.2 2.06,8.13 2.03,8.16 2.03,9.69 2.54,10.19 v6.86,10.19 | JTAG.9 11.15,19.61 11.13,19.59 v7.62,19.59
P30  (via drill 0.3)
  Top 0.305: IC1.15 39.02,16.69 38.27,15.94 v38.22,15.51 | JTAG.5 12.45,13.24 14.99,15.78 v15.49,15.78
  Bottom 0.305: v38.22,15.51 36.16,15.51 35.76,15.1 16.17,15.1 v15.49,15.78 | 12.4,13.43 12.35,13.38 JTAG.5 | JTAG.5 12.35,13.42 12.45,13.51 11.43,14.53 8.37,14.53 6.35,16.54 4.06,16.54 4.03,16.51 R7.1 | JTAG.5 12.35,13.4
P31  (via drill 0.3)
  Top 0.305: IC1.16 40,16.93 40.33,17.26 v40.33,17.46 | v19.86,17.67 19.86,19.19 18.05,21.12 14.73,21.12 JTAG.13
  Bottom 0.305: v40.33,17.46 40.33,17.44 40.3,17.41 40.05,17.67 v19.86,17.67 | 12.37,23.49 12.45,23.42 | 12.37,23.49 JTAG.13 | 12.37,23.49 11.18,24.69 8.89,24.69 7.11,26.47 7.11,28.23 6.35,28.99 3.97,28.99 | 3.97,28.99 3.81,28.99 | R9.1 3.97,28.99
POWEREXT  (via drill 0.3)
  Top 0.406: C8.1 63.13,25.18 63.8,24.51 | 63.8,24.51 63.8,23.75 | 63.8,23.75 63.8,23.49 63.77,23.52 IC3.1 63.73,23.68 63.8,23.75 | IC3.5 62.78,21.72 63.8,22.73 63.8,23.75 | 63.8,15.84 IC4.1 | 63.8,15.84 63.8,17.74 C11.1 63.53,18.41 v64.31,19.19 | C8.1 63.28,26.03 | C8.1 63.29,26.2 CON1.1 | 63.8,24.51 63.8,24.53 | 63.8,15.84 63.8,14.87 63.55,14.87 62.78,14.11 IC4.5
  Bottom 0.305: U$1.18 63.25,34.29 63.29,34.24 CON1.1
  Bottom 0.406: v64.31,19.19 64.31,19.45 63.55,20.21 63.55,28.34 63.29,28.59 CON1.1
RST  (via drill 0.3)
  Top 0.305: IC1.6 v38.65,23.51 | IC2.2 v17.32,22.52 | IC2.2 17.35,23.8 | 12.3,26.03 JTAG.15 14.59,23.8 IC2.2 | IC2.2 17.32,23.86 17.27,23.91 18.14,24.78 v18.33,24.78
  Bottom 0.305: v38.65,23.51 36.11,23.51 33.07,20.34 19.35,20.34 v17.32,22.52 | v18.33,24.78 18.4,24.78 20.07,26.45 20.07,28.99 20.11,29.04 CON1.18 20.11,33.89 20,34 20.07,34.07 U$1.1
RTCK  (via drill 0.3)
  Top 0.305: IC1.26 44.04,14.6 43.66,14.6 43.4,14.34 43.4,13.68 v43.12,13.4 | v19.63,13.98 19.63,15.79 20.11,16.4 20.64,16.93 20.64,19.62 18.54,21.73 v17.04,21.73
  Bottom 0.305: v43.12,13.4 38.32,13.4 37.28,14.44 20.09,14.44 v19.63,13.98 | 12.3,20.9 JTAG.11 | 12.37,20.95 12.45,20.88 | 12.37,20.95 JTAG.11 | 12.37,20.95 11.18,22.15 9.14,22.15 6.62,24.67 4.03,24.67 R10.1 | JTAG.11 12.45,20.86 13.32,21.73 v17.04,21.73
RTXC1  (via drill 0.3)
  Top 0.305: IC1.20 v41.8,15.91
  Bottom 0.305: v41.8,15.91 42.84,15.91 45.56,13.2 50.19,13.2 51.51,14.52 | 51.51,14.52 51.61,14.62 | 51.51,14.52 Q2.2 51.39,15.86 51.1,16.14 C2.1
RTXC2  (via drill 0.3)
  Top 0.305: IC1.25 44.41,13.43 v45.26,12.59
  Bottom 0.305: v45.26,12.59 52.12,12.59 53.93,14.4 Q2.1 53.93,16.11 53.91,16.13 | 53.91,16.13 53.89,16.14 | 53.91,16.13 C1.1
VBAT  (via drill 0.3)
  Top 0.305: IC1.4 41.16,22.4 42.34,21.22 42.34,19.52 v41.02,18.2 | v37.77,14.82 37.33,14.42 35.1,12.16 34.26,12.16 33.8,11.72 30.55,11.72 v30.37,11.55 | 30.32,8.78 30.35,8.8 | 30.32,8.78 CON2.5 30.27,8.72 30.23,8.67 30.23,7.4 28.7,5.88 18.03,5.88 17.53,6.38 D1.3 | 30.32,8.78 30.25,8.7
  Bottom 0.305: v41.02,18.2 41.02,17.26 38.58,14.82 v37.77,14.82 | v30.37,11.55 30.37,9.01 30.2,8.83 30.25,8.78 CON2.5 30.27,8.84 30.23,8.89 U$2.5
VBATEXT  (via drill 0.3)
  Top 0.305: D1.2 16.58,12.55 16,11.97 v16,7.4 | v18.29,6.89 24.89,6.89 25.15,7.15 25.15,8.67 25.19,8.72 CON2.3
  Bottom 0.305: v16,7.4 17.78,7.4 v18.29,6.89 | CON2.3 25.19,8.84 25.15,8.89 U$2.3
X1
  Top 0.305: 38.69,19.92 38.91,19.7 | 38.69,19.92 IC1.11 | 38.69,19.92 37.26,21.35 Q1.2 29.13,21.35 28.75,21.73 C4.1
X2
  Top 0.305: IC1.12 38.26,19.59 38.15,19.7 34.97,16.52 Q1.1 28.88,16.52 28.75,16.65 C3.1

### Text on the board
tNames: RS | 1.8 | 21 | 20 | 19 | 18 | 17 | 16 | 15 | 14 | 13 | 26 | 25 | 12 | GD | VIN | 11 | 0 | 1 | VE | 2 | VB | 3 | 4 | 5 | 6 | 3.3 | 7 | 8 | 9 | 22 | 23 | 24 | 10 | BUZZI-46 V2.1